# Altium schematic sheet Key.SchDoc
size A4
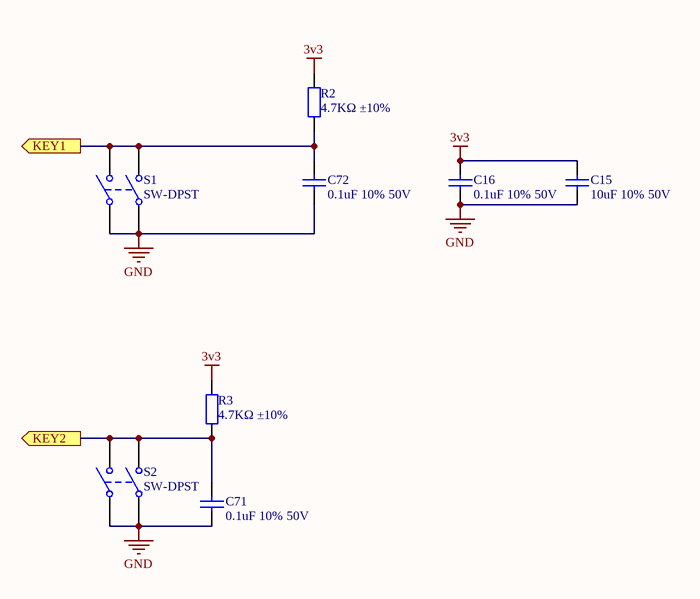
[diagram p0: Key.SchDoc]

## Parts
C15  10uF 10% 50V  [0805_C]
C16  0.1uF 10% 50V  [0603_C]
C71  0.1uF 10% 50V  [0603_C]
C72  0.1uF 10% 50V  [0603_C]
R2  4.7KΩ ±10%  [0603_R]
R3  4.7KΩ ±10%  [0603_R]
S1  SW-DPST  [SW1]
S2  SW-DPST  [SW1]

## Ports
KEY1 (out), KEY2 (out)

## Nets
3v3: C15.2 C16.2 R2.2 R3.2
GND: C15.1 C16.1 C71.1 C72.1 S1.1(COMMON1) S1.3(COMMON2) S2.1(COMMON1) S2.3(COMMON2)
KEY1: C72.2 R2.1 S1.2(NO1) S1.4(NO2) ; port KEY1
KEY2: C71.2 R3.1 S2.2(NO1) S2.4(NO2) ; port KEY2

## Library data of the parts
C15 C16 C71 C72 = 0603 4.7uF (475) 10% 16V: 贴片电容; ComponentLink1Description: 供应商链接; ComponentLink1URL: http://www.szlcsc.com/product/details_20375.html; Package: 0603; Supplier: LC; SuppliersPartNumber: C19666
R2 R3 = 0603 2.2Ω (2R20) 1%: 贴片电阻; ComponentLink1Description: 供应商链接; ComponentLink1URL: http://www.szlcsc.com/product/details_23666.html; Package: 0603; Supplier: LC; SuppliersPartNumber: C22939
S1 S2 = SW-DPST: Double-Pole, Single-Throw Switch; Published: 24-Mar-1999; LatestRevisionDate: 17-Jul-2002; LatestRevisionNote: Re-released for DXP Platform.; PackageReference: DPST-4; Publisher: Altium Limited; PackageDescription: Switch; 4 Leads